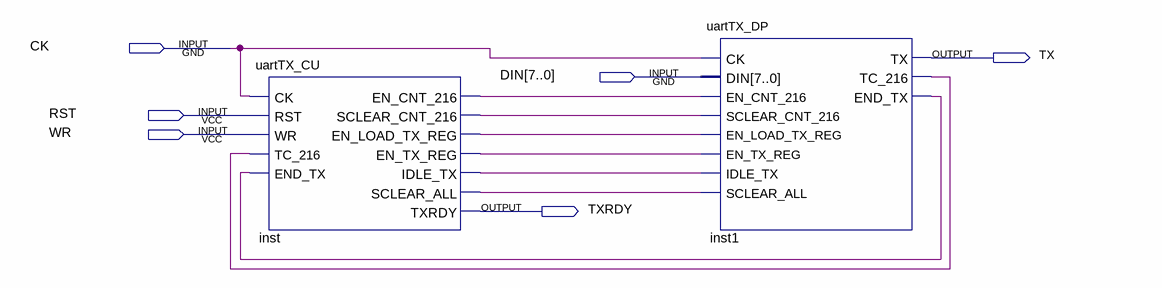
[diagram p0: schematic sheet]
// Quartus schematic uartTX.bdf as structural Verilog: 2 symbols, 6 pins
module uartTX (
  input  CK,
  input  [7:0] DIN,
  input  RST,
  input  WR,
  output TX,
  output TXRDY
);

  wire inst1_end_tx, inst1_tc_216, inst_en_cnt_216, inst_en_load_tx_reg, inst_en_tx_reg, inst_idle_tx,
       inst_sclear_all, inst_sclear_cnt_216;

  uartTX_CU inst (
    .CK(CK), .RST(RST), .WR(WR), .TC_216(inst1_tc_216), .END_TX(inst1_end_tx), .EN_CNT_216(inst_en_cnt_216),
    .SCLEAR_CNT_216(inst_sclear_cnt_216), .EN_LOAD_TX_REG(inst_en_load_tx_reg), .EN_TX_REG(inst_en_tx_reg),
    .IDLE_TX(inst_idle_tx), .SCLEAR_ALL(inst_sclear_all), .TXRDY(TXRDY));
  uartTX_DP inst1 (
    .CK(CK), .DIN(DIN), .EN_CNT_216(inst_en_cnt_216), .SCLEAR_CNT_216(inst_sclear_cnt_216),
    .EN_LOAD_TX_REG(inst_en_load_tx_reg), .EN_TX_REG(inst_en_tx_reg), .IDLE_TX(inst_idle_tx),
    .SCLEAR_ALL(inst_sclear_all), .TX(TX), .TC_216(inst1_tc_216), .END_TX(inst1_end_tx));
endmodule
